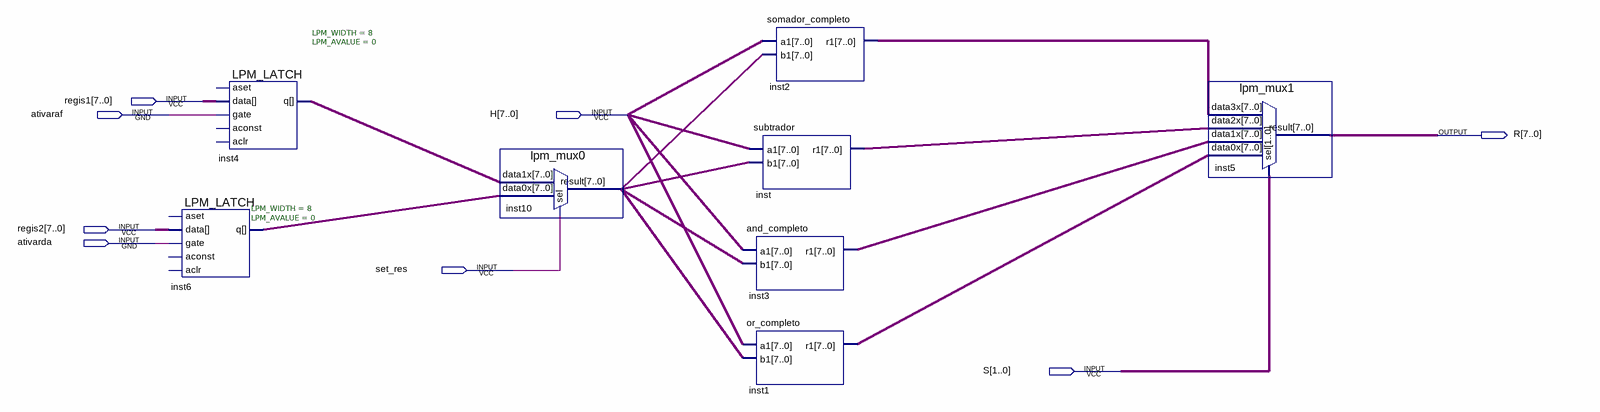
[diagram p0: schematic sheet]
// Quartus schematic ula.bdf as structural Verilog: 8 symbols, 8 pins
module ula (
  input  [7:0] regis1,
  input  ativaraf,
  input  [7:0] H,
  input  [7:0] regis2,
  input  ativarda,
  input  set_res,
  input  [1:0] S,
  output [7:0] R
);

  wire [7:0] inst1_r1, inst2_r1, inst3_r1, inst4_q, inst6_q, inst10_result, inst_r1;

  LPM_LATCH #(.LPM_WIDTH(8), .LPM_AVALUE(0)) inst6 (
    .data(regis2), .gate(ativarda), .q(inst6_q));  // open: aclr, aconst, aset
  LPM_LATCH #(.LPM_WIDTH(8), .LPM_AVALUE(0)) inst4 (
    .data(regis1), .gate(ativaraf), .q(inst4_q));  // open: aclr, aconst, aset
  lpm_mux0 inst10 (.data1x(inst4_q), .data0x(inst6_q), .sel(set_res), .result(inst10_result));
  subtrador inst (.a1(H), .b1(inst10_result), .r1(inst_r1));
  and_completo inst3 (.a1(H), .b1(inst10_result), .r1(inst3_r1));
  or_completo inst1 (.a1(H), .b1(inst10_result), .r1(inst1_r1));
  somador_completo inst2 (.a1(H), .b1(inst10_result), .r1(inst2_r1));
  lpm_mux1 inst5 (.data3x(inst2_r1), .data2x(inst_r1), .data1x(inst3_r1), .data0x(inst1_r1), .sel(S), .result(R));
endmodule
